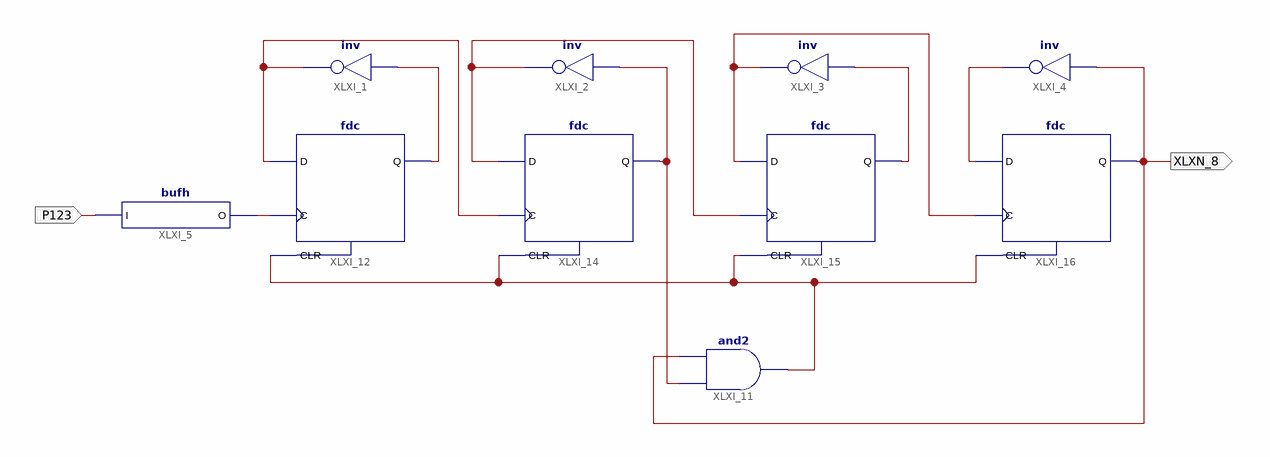
[diagram p0: schematic sheet 1]
// Xilinx ISE schematic divider2_10.sch (spartan6) as structural Verilog: 10 symbols, 2 ports
module divider2_10 (
  input  P123,
  output XLXN_8
);

  wire XLXN_1, XLXN_2, XLXN_3, XLXN_4, XLXN_5, XLXN_6, XLXN_9, XLXN_10, XLXN_17;

  not XLXI_1 (XLXN_9, XLXN_1);
  not XLXI_2 (XLXN_2, XLXN_3);
  not XLXI_3 (XLXN_4, XLXN_5);
  not XLXI_4 (XLXN_6, XLXN_8);
  bufh XLXI_5 (.I(P123), .O(XLXN_10));
  and XLXI_11 (XLXN_17, XLXN_3, XLXN_8);
  fdc XLXI_12 (.C(XLXN_10), .CLR(XLXN_17), .D(XLXN_9), .Q(XLXN_1));
  fdc XLXI_14 (.C(XLXN_9), .CLR(XLXN_17), .D(XLXN_2), .Q(XLXN_3));
  fdc XLXI_15 (.C(XLXN_2), .CLR(XLXN_17), .D(XLXN_4), .Q(XLXN_5));
  fdc XLXI_16 (.C(XLXN_4), .CLR(XLXN_17), .D(XLXN_6), .Q(XLXN_8));
endmodule
